# Altium schematic sheet Logik Output.SchDoc
size A4; SheetNumber: 2; SheetTotal: 7
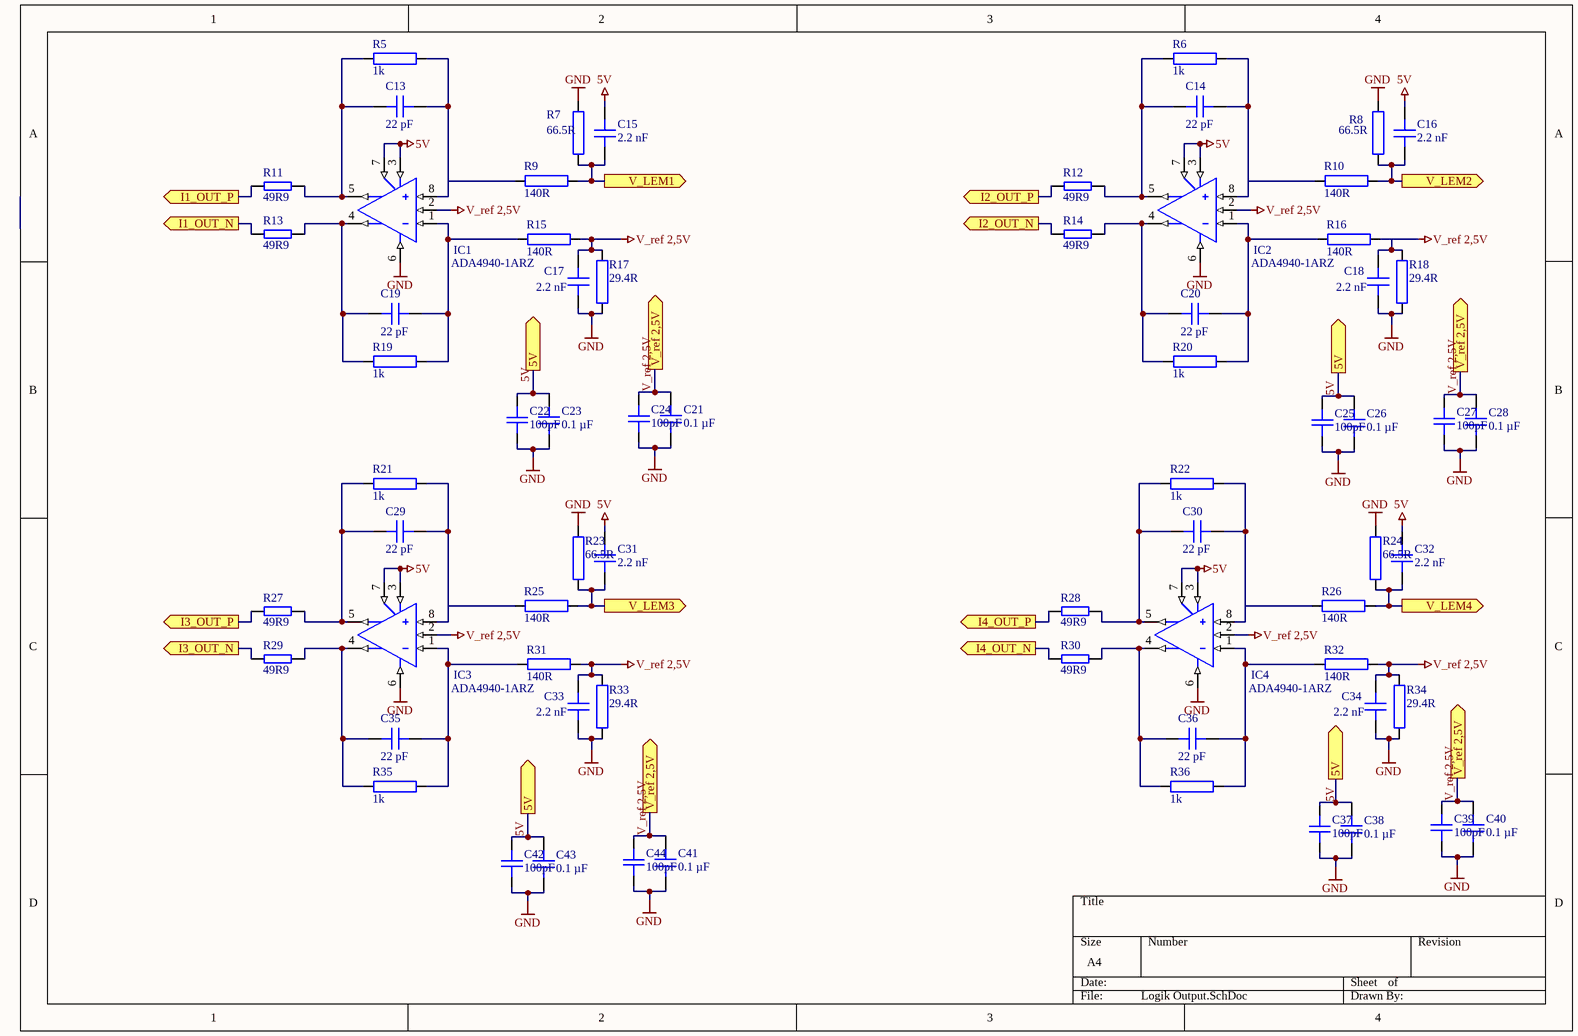
[diagram p0: Logik Output.SchDoc]

## Parts
C13  22 pF  [C_0603]
C14  22 pF  [C_0603]
C15  2.2 nF  [C_0603]
C16  2.2 nF  [C_0603]
C17  2.2 nF  [C_0603]
C18  2.2 nF  [C_0603]
C19  22 pF  [C_0603]
C20  22 pF  [C_0603]
C21  0.1 µF  [C_0603]
C22  100pF  [C0805]
C23  0.1 µF  [C_0603]
C24  100pF  [C0805]
C25  100pF  [C0805]
C26  0.1 µF  [C_0603]
C27  100pF  [C0805]
C28  0.1 µF  [C_0603]
C29  22 pF  [C_0603]
C30  22 pF  [C_0603]
C31  2.2 nF  [C_0603]
C32  2.2 nF  [C_0603]
C33  2.2 nF  [C_0603]
C34  2.2 nF  [C_0603]
C35  22 pF  [C_0603]
C36  22 pF  [C_0603]
C37  100pF  [C0805]
C38  0.1 µF  [C_0603]
C39  100pF  [C0805]
C40  0.1 µF  [C_0603]
C41  0.1 µF  [C_0603]
C42  100pF  [C0805]
C43  0.1 µF  [C_0603]
C44  100pF  [C0805]
IC1  ADA4940-1ARZ  [ADA4940-1ARZ-R7]
IC2  ADA4940-1ARZ  [ADA4940-1ARZ-R7]
IC3  ADA4940-1ARZ  [ADA4940-1ARZ-R7]
IC4  ADA4940-1ARZ  [ADA4940-1ARZ-R7]
R5  1k  [R0805]
R6  1k  [R0805]
R7  66.5R  [R0805]
R8  66.5R  [R0805]
R9  140R  [R0805]
R10  140R  [R0805]
R11  49R9  [RES 0603_1608]
R12  49R9  [RES 0603_1608]
R13  49R9  [RES 0603_1608]
R14  49R9  [RES 0603_1608]
R15  140R  [R0805]
R16  140R  [R0805]
R17  29.4R  [R0805]
R18  29.4R  [R0805]
R19  1k  [R0805]
R20  1k  [R0805]
R21  1k  [R0805]
R22  1k  [R0805]
R23  66.5R  [R0805]
R24  66.5R  [R0805]
R25  140R  [R0805]
R26  140R  [R0805]
R27  49R9  [RES 0603_1608]
R28  49R9  [RES 0603_1608]
R29  49R9  [RES 0603_1608]
R30  49R9  [RES 0603_1608]
R31  140R  [R0805]
R32  140R  [R0805]
R33  29.4R  [R0805]
R34  29.4R  [R0805]
R35  1k  [R0805]
R36  1k  [R0805]

## Ports
5V (out), I1_OUT_N (out), I1_OUT_P (out), I2_OUT_N (out), I2_OUT_P (out), I3_OUT_N (out), I3_OUT_P (out), I4_OUT_N (out), I4_OUT_P (out), V_LEM1 (out), V_LEM2 (out), V_LEM3 (out), V_LEM4 (out), V_ref 2,5V (out)

## Nets
5V: C15.2 C16.2 C22.2 C23.2 C25.2 C26.2 C31.2 C32.2 C37.2 C38.2 C42.2 C43.2 IC1.3(V+) IC1.7(EN) IC2.3(V+) IC2.7(EN) IC3.3(V+) IC3.7(EN) IC4.3(V+) IC4.7(EN) ; port 5V
GND: C17.2 C18.2 C21.1 C22.1 C23.1 C24.1 C25.1 C26.1 C27.1 C28.1 C33.2 C34.2 C37.1 C38.1 C39.1 C40.1 C41.1 C42.1 C43.1 C44.1 IC1.6(V-) IC2.6(V-) IC3.6(V-) IC4.6(V-) R7.1 R8.2 R17.1 R18.1 R23.2 R24.2 R33.1 R34.1
V_ref 2,5V: C17.1 C18.1 C21.2 C24.2 C27.2 C28.2 C33.1 C34.1 C39.2 C40.2 C41.2 C44.2 IC1.2(OCM) IC2.2(OCM) IC3.2(OCM) IC4.2(OCM) R15.2 R16.2 R17.2 R18.2 R31.2 R32.2 R33.2 R34.2 ; port V_ref 2,5V
I1_OUT_N: R13.1 ; port I1_OUT_N
I1_OUT_P: R11.1 ; port I1_OUT_P
I2_OUT_N: R14.1 ; port I2_OUT_N
I2_OUT_P: R12.1 ; port I2_OUT_P
I3_OUT_N: R29.1 ; port I3_OUT_N
I3_OUT_P: R27.1 ; port I3_OUT_P
I4_OUT_N: R30.1 ; port I4_OUT_N
I4_OUT_P: R28.1 ; port I4_OUT_P
V_LEM1: C15.1 R7.2 R9.2 ; port V_LEM1
V_LEM2: C16.1 R8.1 R10.2 ; port V_LEM2
V_LEM3: C31.1 R23.1 R25.2 ; port V_LEM3
V_LEM4: C32.1 R24.1 R26.2 ; port V_LEM4
NetC13_1: C13.1 IC1.5(OUT) R5.1 R11.2
NetC13_2: C13.2 IC1.8(+) R5.2 R9.1
NetC14_1: C14.1 IC2.5(OUT) R6.1 R12.2
NetC14_2: C14.2 IC2.8(+) R6.2 R10.1
NetC19_1: C19.1 IC1.4(OUT) R13.2 R19.1
NetC19_2: C19.2 IC1.1(-) R15.1 R19.2
NetC20_1: C20.1 IC2.4(OUT) R14.2 R20.1
NetC20_2: C20.2 IC2.1(-) R16.1 R20.2
NetC29_1: C29.1 IC3.5(OUT) R21.1 R27.2
NetC29_2: C29.2 IC3.8(+) R21.2 R25.1
NetC30_1: C30.1 IC4.5(OUT) R22.1 R28.2
NetC30_2: C30.2 IC4.8(+) R22.2 R26.1
NetC35_1: C35.1 IC3.4(OUT) R29.2 R35.1
NetC35_2: C35.2 IC3.1(-) R31.1 R35.2
NetC36_1: C36.1 IC4.4(OUT) R30.2 R36.1
NetC36_2: C36.2 IC4.1(-) R32.1 R36.2

## Library data of the parts
C13 C14 C19 C20 C29 C30 C35 C36 = C0603C220J5RACTU: Capacitor 0603, 50 VDC, 22 pF, X7R; Manufacturer: KEMET; Tolerance: 5 %; Voltage Rating: 50 VDC; Created from: MGremer; Manufacturer Part Number: C0603C220J5RACTU; PartID: 78; Created On: 20.12.2020 13:54:13; ComponentLink1Description: Datasheet; ComponentLink1URL: https://www.mouser.de/datasheet/2/212/KEM_C1002_X7R_SMD-1102033.pdf; Component Type: Capacitor 0603; Device Package: 0603; Last Updated: 20.01.2021 13:57:36; Mounting Type: SMD; Operating Temperature: -55 - 125°C; Series: SMD Comm X7R; Supplier 1: Mouser; Supplier Part Number 1: 80-C0603C220J5R; Type: Capacitor; Value: 22 pF; Live Cycle Status: 1; Stock number: not stored
C15-C18 C31-C34 = 06035C222JAT2A: Capacitor 0603, 50 VDC, 2.2 nF, X7R; Manufacturer: AVX; Tolerance: 5 %; Voltage Rating: 50 VDC; Created from: MGremer; Manufacturer Part Number: 06035C222JAT2A; PartID: 77; Created On: 20.12.2020 13:54:13; ComponentLink1Description: Datasheet; ComponentLink1URL: https://www.mouser.de/datasheet/2/40/X7RDielectric-777024.pdf; Component Type: Capacitor 0603; Device Package: 0603; Last Updated: 20.01.2021 13:57:36; Mounting Type: SMD; Operating Temperature: -55 - 125°C; Series: MLCC X7R; Supplier 1: Mouser; Supplier Part Number 1: 581-06035C222J; Type: Capacitor; Value: 2.2 nF; Live Cycle Status: 1; Stock number: not stored
C21 C23 C26 C28 C38 C40 C41 C43 = C0603X104K5RAC7411: Capacitor 0603, 50 VDC, 0.1 µF, X7R; Manufacturer: KEMET; Tolerance: 10 %; Voltage Rating: 50 VDC; Created from: MGremer; Manufacturer Part Number: C0603X104K5RAC7411; PartID: 3; Created On: 20.12.2020 13:54:13; ComponentLink1Description: Datasheet; ComponentLink1URL: https://www.mouser.de/datasheet/2/212/1/KEM_C1013_X7R_FT_CAP_SMD-1103280.pdf; Component Type: Capacitor 0603; Device Package: 0603; Last Updated: 04.03.2021 09:24:28; Mounting Type: SMD; Operating Temperature: -55 - 125°C; Series: SMD Comm X7R Flex; Supplier 1: Mouser; Supplier Part Number 1: 80-C0603X104K5R7411; Supplier 2: LCSC; Supplier Part Number 2: C14663; Type: Capacitor; Value: 0.1 µF; Live Cycle Status: 1; LCSC Part Number: C14663; Stock number: Labor SMD Container
C22 C24 C25 C27 C37 C39 C42 C44 = 08055A101FAT2A: 0805 100 pF 50 V ±1 % Tolerance C0G/NP0 SMT Multilayer Ceramic Capacitor; Manufacturer: Kyocera AVX; Tolerance: 1%; Voltage Rating (DC): 50V; Dielectric: C0G; Supplier 1: Mouser; Supplier Part Number 1: 581-08055A101F; Manufacturer Part Number: 08055A101FAT2A; RoHS: Yes; Category: Ceramic Capacitors; Stock 1: 20741; Pricing 1: 1=0,59000, 10=0,41500, 50=0,41500, 100=0,27400, 1000=0,19700, 10000=0,14100 (USD); Mount: Surface Mount; Case/Package: 0805; Case Code (Imperial): 0805; Case Code (Metric): 2012; Contact Plating: Tin,Matte; Min Operating Temperature: -55°C; Max Operating Temperature: 125°C; Packaging: Tape and Reel; Capacitance: 100pF; Voltage Rating: 50V; Package Quantity: 1; Termination: SMD/SMT; Length: 2.01mm; Width: 1.25mm; Height: 0.94mm; Thickness: 0.037inch; Depth: 1.25mm; Radiation Hardening: No; RoHS Compliant: Yes; REACH SVHC: No SVHC; Lead Free: Lead Free; ComponentLink1URL: https://datasheet.ciiva.com/213/ccog-213068.pdf?src-supplier=Digi-Key; ComponentLink1Description: https://datasheet.ciiva.com/213/ccog-213068.pdf?src-supplier=Digi-Key; ComponentLink2URL: https://datasheet.ciiva.com/28586/1796416-28586125.pdf?src-supplier=Element14; ComponentLink2Description: https://datasheet.ciiva.com/28586/1796416-28586125.pdf?src-supplier=Element14; ComponentLink3URL: https://datasheet.ciiva.com/14906/ccog-14906197.pdf?src-supplier=Digi-Key; ComponentLink3Description: https://datasheet.ciiva.com/14906/ccog-14906197.pdf?src-supplier=Digi-Key; ComponentLink4URL: https://datasheet.ciiva.com/7614/ccog-7614717.pdf?src-supplier=Digi-Key; ComponentLink4Description: https://datasheet.ciiva.com/7614/ccog-7614717.pdf?src-supplier=Digi-Key; ComponentLink5URL: https://datasheet.ciiva.com/14906/ccog-14906199.pdf?src-supplier=Digi-Key; ComponentLink5Description: https://datasheet.ciiva.com/14906/ccog-14906199.pdf?src-supplier=Digi-Key
IC1-IC4 = ADA4940-1ARZ_1: IC OPAMP DIFF 260MHZ 8SOIC; Manufacturer: Analog Devices; Slew Rate: 95V/µs; Input Offset Voltage (Vos): 60uV; Common Mode Rejection Ratio: 86dB; Number of Channels: 1; Max Supply Voltage: 6V; Min Supply Voltage: 3V; Operating Supply Voltage: 5V; Power Supply Rejection Ratio (PSRR): 80dB; Input Bias Current: 1.1uA; Operating Supply Current: 1.18mA; Output Current per Channel: 46mA; Input Resistance: 50MR; Test Frequency: 50kHz; Amplifier Type: DIFFERENTIAL; Nominal Supply Current: 1.25mA; Settling Time: 34ns; Max Supply Current: 13.5uA; Supplier 1: Mouser; Supplier Part Number 1: 584-ADA4940-1ARZ; Manufacturer Part Number: ADA4940-1ARZ; RoHS: Yes; Category: Amplifiers - Op Amps, Buffer, Instrumentation; Stock 1: 3938; Pricing 1: 1=5,14000, 10=4,62000, 50=4,37000, 100=3,78000, 1000=3,21000, 10000=2,74000 (USD); Case/Package: SOIC; Number of Pins: 8; Contact Plating: Tin,Matte; Min Operating Temperature: -40°C; Max Operating Temperature: 125°C; Package Quantity: 98; -3db Bandwidth: 260MHz; Packaging: Rail/Tube; Number of Circuits: 1; Gain Bandwidth Product: 260MHz; Number of Elements: 1; Quiescent Current: 1.18mA; Series: -; Bandwidth: 260MHz; Number of Amplifiers: 1; Supply Current: 1.25mA; Length: 5mm; Width: 4mm; Height: 1.5mm; Radiation Hardening: No; Lead Free: Contains Lead; RoHS Compliant: Yes; REACH SVHC: No SVHC; ComponentLink1URL: https://datasheet.ciiva.com/1578/ada4940-1-4940-2-1578032.pdf?src-supplier=Newark; ComponentLink1Description: https://datasheet.ciiva.com/1578/ada4940-1-4940-2-1578032.pdf?src-supplier=Newark; ComponentLink2URL: https://datasheet.ciiva.com/15129/getdatasheetpartid-486836-15129044.pdf?src-supplier=Verical; ComponentLink2Description: https://datasheet.ciiva.com/15129/getdatasheetpartid-486836-15129044.pdf?src-supplier=Verical; ComponentLink3URL: https://datasheet.ciiva.com/1485/1790104-1485202.pdf?src-supplier=Element14; ComponentLink3Description: https://datasheet.ciiva.com/1485/1790104-1485202.pdf?src-supplier=Element14; ComponentLink4URL: https://datasheet.ciiva.com/8036/1790104-8036687.pdf?src-supplier=Element14; ComponentLink4Description: https://datasheet.ciiva.com/8036/1790104-8036687.pdf?src-supplier=Element14; ComponentLink5URL: https://datasheet.ciiva.com/2965/ada4940-1-4940-2-2965446.pdf?src-supplier=Avnet; ComponentLink5Description: https://datasheet.ciiva.com/2965/ada4940-1-4940-2-2965446.pdf?src-supplier=Avnet; ComponentLink6URL: https://datasheet.ciiva.com/1808/ada4940-1-4940-2-1808830.pdf?src-supplier=Digi-Key; ComponentLink6Description: https://datasheet.ciiva.com/1808/ada4940-1-4940-2-1808830.pdf?src-supplier=Digi-Key
R5 R6 R19-R22 R35 R36 = CR0805-FX-1001ELF: Res Thick Film 0805 1 kOhm 1% 0.125W(1/8W) ±100ppm/C Molded SMD Paper Tape on Plastic Reel; Manufacturer: Bourns; Manufacturer Part Number: CR0805-FX-1400ELF; Voltage Rating: 150V; Resistance: 140R; Power Rating: 125mW; Temperature Coefficient: 100ppm/°C; RoHS: Yes; Category: Chip SMD Resistors; Stock 1: 33845; Pricing 1: 1=0,10000, 10=0,02900, 50=0,02900, 100=0,01200, 1000=0,00600, 10000=0,00400 (USD); Mount: Surface Mount; Case/Package: 0805; Case Code (Imperial): 0805; Case Code (Metric): 2012; Contact Plating: Tin; Min Operating Temperature: -55°C; Max Operating Temperature: 155°C; Packaging: Tape and Reel; Tolerance: 1%; Package Quantity: 5000; Resistor Type: Thick Film; Termination: SMD/SMT; Number of Terminations: 2; Max Power Dissipation: 125mW; Features: Moisture Resistant; Series: CR0805; Construction: Rectangular; Length: 2mm; Width: 1.25mm; Height: 0.024inch; Depth: 1.25mm; Thickness: 508um; Radiation Hardening: No; Military Standard: Not; RoHS Compliant: Yes; ComponentLink1URL: https://datasheet.ciiva.com/9120/chpreztr-9120519.pdf?src-supplier=Avnet; ComponentLink1Description: https://datasheet.ciiva.com/9120/chpreztr-9120519.pdf?src-supplier=Avnet; ComponentLink2URL: https://datasheet.ciiva.com/14985/chpreztr-14985975.pdf?src-supplier=Digi-Key; ComponentLink2Description: https://datasheet.ciiva.com/14985/chpreztr-14985975.pdf?src-supplier=Digi-Key; Supplier 1: Arrow Electronics; Supplier Part Number 1: CR0805-FX-1001ELF
R7 = CR0805-FX-66R5ELF: Res Thick Film 0805 66.5 Ohm 1% 1/8W ±100ppm/°C Molded SMD SMD Paper Tape on Plastic Reel; Manufacturer: Bourns; Power Rating: 125mW; Voltage Rating: 150V; Supplier 1: Mouser; Supplier Part Number 1: 652-CR0805FX-66R5ELF; Manufacturer Part Number: CR0805-FX-66R5ELF; RoHS: Yes; Category: Chip SMD Resistors; Stock 1: 24351; Pricing 1: 1=0,10000, 10=0,02900, 50=0,02900, 100=0,01200, 1000=0,00600, 10000=0,00400 (USD); Mount: Surface Mount; Case/Package: 0805; Case Code (Imperial): 0805; Case Code (Metric): 2012; Contact Plating: Tin; Min Operating Temperature: -55°C; Max Operating Temperature: 155°C; Packaging: Tape and Reel; Package Quantity: 5000; Resistance: 66.5R; Tolerance: 1%; Resistor Type: Thick Film; Termination: SMD/SMT; Number of Terminations: 2; Temperature Coefficient: 100ppm/°C; Max Power Dissipation: 125mW; Features: Moisture Resistant; Series: CR0805; Construction: Rectangular; Length: 2mm; Width: 1.25mm; Height: 0.024inch; Depth: 1.25mm; Thickness: 508um; Radiation Hardening: No; Military Standard: Not; RoHS Compliant: Yes; ComponentLink1URL: https://datasheet.ciiva.com/9121/chpreztr-9121029.pdf?src-supplier=Avnet; ComponentLink1Description: https://datasheet.ciiva.com/9121/chpreztr-9121029.pdf?src-supplier=Avnet; ComponentLink2URL: https://datasheet.ciiva.com/14985/chpreztr-14985685.pdf?src-supplier=Digi-Key; ComponentLink2Description: https://datasheet.ciiva.com/14985/chpreztr-14985685.pdf?src-supplier=Digi-Key
R8 R23 R24 = ERJ-XGNF54R9Y: Res Thick Film 01005 54.9 Ohm 1% 0.031W(1/32W) ±300ppm/°C Molded SMD Pressed Carrier T/R; Manufacturer: Panasonic; Resistance: 54.9R; Power Rating: 31mW; Voltage Rating: 15V; Supplier 1: Mouser; Supplier Part Number 1: 667-ERJ-XGNF54R9Y; Manufacturer Part Number: ERJ-XGNF54R9Y; RoHS: Yes; Category: Chip SMD Resistors; Stock 1: 14261; Pricing 1: 1=0,52000, 10=0,37400, 50=0,37400, 100=0,15000, 1000=0,07400, 10000=0,06200 (USD); Mount: Surface Mount; Case/Package: Molded; Case Code (Metric): 0402; Case Code (Imperial): 1005; Min Operating Temperature: -55°C; Max Operating Temperature: 125°C; Termination: SMD/SMT; Temperature Coefficient: 300ppm/°C; Resistor Type: Thick Film; Packaging: Tape and Reel; Tolerance: 1%; Package Quantity: 20000; Length: 0.4mm; Width: 0.2mm; Height: 0.13mm; ComponentLink1URL: http://www.onlinecomponents.com/datasheet/erj-xgnf54r9y.aspx?p=44478308&src-supplier=Onlinecomponents.com; ComponentLink1Description: http://www.onlinecomponents.com/datasheet/erj-xgnf54r9y.aspx?p=44478308&src-supplier=Onlinecomponents.com; ComponentLink2URL: http://www.mouser.com/ds/2/315/AOA0000CE2-37512.pdf?src-supplier=Mouser; ComponentLink2Description: http://www.mouser.com/ds/2/315/AOA0000CE2-37512.pdf?src-supplier=Mouser
R9 R10 R15 R16 R25 R26 R31 R32 = CR0805-FX-1400ELF: Res Thick Film 0805 140 Ohm 1% 0.125W(1/8W) ±100ppm/C Molded SMD Paper Tape on Plastic Reel; Manufacturer: Bourns; Voltage Rating: 150V; Power Rating: 125mW; Temperature Coefficient: 100ppm/°C; Supplier 1: Mouser; Supplier Part Number 1: 652-CR0805FX-1400ELF; Manufacturer Part Number: CR0805-FX-1400ELF; RoHS: Yes; Category: Chip SMD Resistors; Stock 1: 33845; Pricing 1: 1=0,10000, 10=0,02900, 50=0,02900, 100=0,01200, 1000=0,00600, 10000=0,00400 (USD); Mount: Surface Mount; Case/Package: 0805; Case Code (Imperial): 0805; Case Code (Metric): 2012; Contact Plating: Tin; Min Operating Temperature: -55°C; Max Operating Temperature: 155°C; Resistance: 140R; Packaging: Tape and Reel; Tolerance: 1%; Package Quantity: 5000; Resistor Type: Thick Film; Termination: SMD/SMT; Number of Terminations: 2; Max Power Dissipation: 125mW; Features: Moisture Resistant; Series: CR0805; Construction: Rectangular; Length: 2mm; Width: 1.25mm; Height: 0.024inch; Depth: 1.25mm; Thickness: 508um; Radiation Hardening: No; Military Standard: Not; RoHS Compliant: Yes; ComponentLink1URL: https://datasheet.ciiva.com/9120/chpreztr-9120519.pdf?src-supplier=Avnet; ComponentLink1Description: https://datasheet.ciiva.com/9120/chpreztr-9120519.pdf?src-supplier=Avnet; ComponentLink2URL: https://datasheet.ciiva.com/14985/chpreztr-14985975.pdf?src-supplier=Digi-Key; ComponentLink2Description: https://datasheet.ciiva.com/14985/chpreztr-14985975.pdf?src-supplier=Digi-Key
R11-R14 R27-R30 = RN73H1JTTD49R9F100: SMD resistor 1%; Manufacturer: KOA Speer; Created from: MGremer; Manufacturer Part Number: RN73H1JTTD49R9F100; PartID: 189; Created On: 14.12.2020 16:17:14; ComponentLink1Description: Datasheet; ComponentLink1URL: https://www.mouser.de/datasheet/2/219/RN73H-1843478.pdf; Component Type: SMD resistor; Device Package: 0603; Last Updated: 02.07.2021 11:49:34; Mounting Type: SMD; Supplier 1: Mouser; Supplier Part Number 1: 660-RN73H1JT49R9F100; Type: Resistor; Tolerance: 1%; Value: 49R9; Live Cycle Status: 1; Stock number: not stored
R17 R18 R33 R34 = CHP2512AJW-270ELF: Res Thick Film 2512 27 Ohm 5% 3W ±200ppm/°C Sulfur Resistant Pad SMD Automotive T/R; Manufacturer: Bourns; Supplier 1: Mouser; Supplier Part Number 1: 652-CHP2512AJW-270L; Manufacturer Part Number: CHP2512AJW-270ELF; RoHS: Yes; Category: Chip SMD Resistors; Stock 1: 16141; Pricing 1: 1=1,47000, 10=0,73000, 50=0,73000, 100=0,53200, 1000=0,33700, 10000=0,28200 (USD)